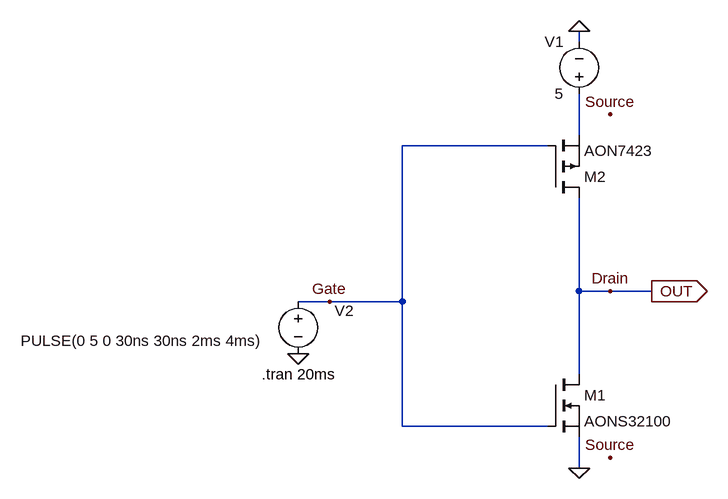
[diagram p0: schematic TP2_NOT.asc]
TP2_NOT.asc, the LTspice schematic file:
Version 4
SHEET 1 880 692
WIRE -944 -528 -944 -544
WIRE -944 -384 -944 -448
WIRE -992 -368 -1216 -368
WIRE -944 -144 -944 -288
WIRE -896 -144 -944 -144
WIRE -832 -144 -896 -144
WIRE -1328 -128 -1376 -128
WIRE -1216 -128 -1216 -368
WIRE -1216 -128 -1328 -128
WIRE -944 -16 -944 -144
WIRE -1216 64 -1216 -128
WIRE -992 64 -1216 64
WIRE -944 128 -944 80
FLAG -944 128 0
FLAG -944 -544 0
FLAG -1376 -48 0
FLAG -832 -144 OUT
IOPIN -832 -144 Out
FLAG -1328 -128 Gate
FLAG -896 112 Source
FLAG -896 -416 Source
FLAG -896 -144 Drain
SYMBOL voltage -944 -432 R180
WINDOW 0 24 96 Left 2
WINDOW 3 24 16 Left 2
WINDOW 123 0 0 Left 0
WINDOW 39 0 0 Left 0
SYMATTR InstName V1
SYMATTR Value 5
SYMBOL voltage -1376 -144 R0
WINDOW 3 -427 76 Left 2
WINDOW 123 0 0 Left 0
WINDOW 39 0 0 Left 0
WINDOW 0 56 30 Left 2
SYMATTR Value PULSE(0 5 0 30ns 30ns 2ms 4ms)
SYMATTR InstName V2
SYMBOL nmos -992 -16 R0
SYMATTR InstName M1
SYMATTR Value AONS32100
SYMBOL pmos -992 -288 M180
SYMATTR InstName M2
SYMATTR Value AON7423
TEXT -1432 -16 Left 2 !.tran 20ms

The netlist it stands for:
* TP2_NOT.asc
V1 N001 0 5
V2 Gate 0 PULSE(0 5 0 30ns 30ns 2ms 4ms)
M1 Drain Gate 0 0 AONS32100
M2 Drain Gate N001 N001 AON7423
.model NMOS NMOS
.model PMOS PMOS
.lib standard.mos
.tran 20ms
.backanno
.end